# Altium schematic sheet arduino_shield.SchDoc: Arduino Shield
size A4; Organization: Badgerloop Electrical; Address1: 133 Engineering Research Building; Address2: 1500 Engineering Drive; Address3: Madison, Wi 53706
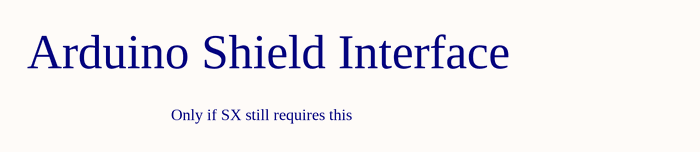
[diagram p0: arduino_shield.SchDoc]

## Notes on the sheet
- Arduino Shield Interface
- Only if SX still requires this
- Title
- Engineer:
- Date:
- Time:
- Revision:
- Sheet
- of
- File: